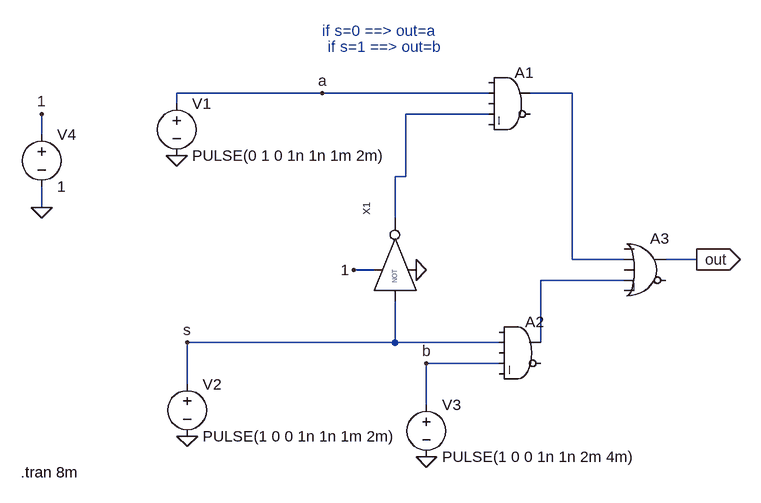
[diagram p0: schematic 2-1 mux.asc]
2-1 mux.asc, the LTspice schematic file:
Version 4
SHEET 1 880 680
WIRE -16 -128 -240 -128
WIRE 240 -128 -16 -128
WIRE 368 -128 304 -128
WIRE -240 -112 -240 -128
WIRE 240 -96 112 -96
WIRE -448 -64 -448 -96
WIRE 112 0 112 -96
WIRE 112 0 96 0
WIRE -448 48 -448 16
WIRE 96 64 96 0
WIRE 368 128 368 -128
WIRE 448 128 368 128
WIRE 560 128 512 128
WIRE 64 144 32 144
WIRE 448 160 320 160
WIRE 96 256 96 192
WIRE 96 256 -224 256
WIRE 256 256 96 256
WIRE 320 256 320 160
WIRE 256 288 144 288
WIRE -224 320 -224 256
WIRE 144 352 144 288
FLAG 128 144 0
FLAG -240 -32 0
FLAG -224 400 0
FLAG 144 432 0
FLAG -448 -96 1
FLAG 32 144 1
FLAG -448 48 0
FLAG 560 128 out
IOPIN 560 128 Out
FLAG -16 -128 a
FLAG 144 288 b
FLAG -224 256 s
SYMBOL Digital\\and 272 -176 R0
SYMATTR InstName A1
SYMBOL Digital\\and 288 208 R0
SYMATTR InstName A2
SYMBOL Digital\\or 480 80 R0
SYMATTR InstName A3
SYMBOL NOT4 112 128 R270
SYMATTR InstName X1
SYMBOL voltage -240 -128 R0
WINDOW 123 0 0 Left 0
WINDOW 39 0 0 Left 0
SYMATTR InstName V1
SYMATTR Value PULSE(0 1 0 1n 1n 1m 2m)
SYMBOL voltage -224 304 R0
WINDOW 123 0 0 Left 0
WINDOW 39 0 0 Left 0
SYMATTR InstName V2
SYMATTR Value PULSE(1 0 0 1n 1n 1m 2m)
SYMBOL voltage 144 336 R0
WINDOW 123 0 0 Left 0
WINDOW 39 0 0 Left 0
SYMATTR InstName V3
SYMATTR Value PULSE(1 0 0 1n 1n 2m 4m)
SYMBOL voltage -448 -80 R0
WINDOW 123 0 0 Left 0
WINDOW 39 0 0 Left 0
SYMATTR InstName V4
SYMATTR Value 1
TEXT -480 456 Left 2 !.tran 8m
TEXT -16 -224 Left 2 ;if s=0 ==> out=a
TEXT -8 -200 Left 2 ;if s=1 ==> out=b

The netlist it stands for:
* 2-1 mux.asc
A1 0 a 0 N002 0 0 N001 0 AND
A2 0 s 0 b 0 0 N003 0 AND
A3 0 N001 0 N003 0 0 out 0 OR
XX1 s 1 0 N002 NOT4  ; pins A VH VL OUT
V1 a 0 PULSE(0 1 0 1n 1n 1m 2m)
V2 s 0 PULSE(1 0 0 1n 1n 1m 2m)
V3 b 0 PULSE(1 0 0 1n 1n 2m 4m)
V4 1 0 1
.tran 8m
* if s=0 ==> out=a
* if s=1 ==> out=b
.backanno
.end